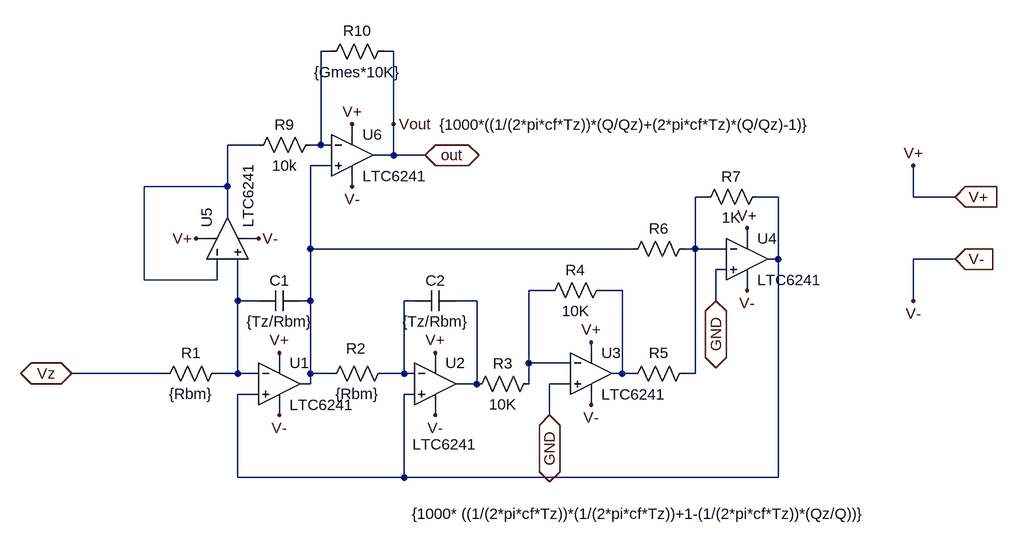
[diagram p0: schematic resonAO.asc]
resonAO.asc, the LTspice schematic file:
Version 4
SHEET 1 1308 680
WIRE 256 -144 240 -144
WIRE 352 -144 336 -144
WIRE 352 -32 352 -144
WIRE 288 -16 288 -32
WIRE 144 0 96 0
WIRE 240 0 240 -144
WIRE 240 0 224 0
WIRE 256 0 240 0
WIRE 352 16 352 -32
WIRE 352 16 320 16
WIRE 400 16 352 16
WIRE 256 32 224 32
WIRE 96 64 96 0
WIRE 96 64 -32 64
WIRE 288 64 288 48
WIRE 832 80 816 80
WIRE 944 80 912 80
WIRE 1152 80 1152 32
WIRE 1216 80 1152 80
WIRE 96 112 96 64
WIRE 64 144 48 144
WIRE 144 144 128 144
WIRE 896 144 896 128
WIRE 224 160 224 32
WIRE 720 160 224 160
WIRE 816 160 816 80
WIRE 816 160 800 160
WIRE 864 160 816 160
WIRE 944 176 944 80
WIRE 944 176 928 176
WIRE 1216 176 1152 176
WIRE 864 192 848 192
WIRE -32 208 -32 64
WIRE 80 208 80 176
WIRE 80 208 -32 208
WIRE 592 224 560 224
WIRE 704 224 672 224
WIRE 896 224 896 208
WIRE 112 240 112 176
WIRE 144 240 112 240
WIRE 224 240 224 160
WIRE 224 240 208 240
WIRE 384 240 368 240
WIRE 480 240 448 240
WIRE 848 240 848 192
WIRE 1152 240 1152 176
WIRE 656 320 656 304
WIRE 176 336 176 320
WIRE 416 336 416 320
WIRE 560 336 560 224
WIRE 624 336 560 336
WIRE 0 352 -144 352
WIRE 112 352 112 240
WIRE 112 352 80 352
WIRE 144 352 112 352
WIRE 224 352 224 240
WIRE 256 352 224 352
WIRE 368 352 368 240
WIRE 368 352 336 352
WIRE 384 352 368 352
WIRE 704 352 704 224
WIRE 704 352 688 352
WIRE 720 352 704 352
WIRE 816 352 816 160
WIRE 816 352 800 352
WIRE 224 368 224 352
WIRE 224 368 208 368
WIRE 480 368 480 240
WIRE 480 368 448 368
WIRE 560 368 560 336
WIRE 624 368 592 368
WIRE 144 384 112 384
WIRE 384 384 368 384
WIRE 656 400 656 384
WIRE 176 416 176 400
WIRE 416 416 416 400
WIRE 592 416 592 368
WIRE 112 512 112 384
WIRE 368 512 368 384
WIRE 368 512 112 512
WIRE 944 512 944 176
WIRE 944 512 368 512
FLAG 352 -32 Vout
FLAG -144 352 Vz
IOPIN -144 352 BiDir
FLAG 1216 80 V+
IOPIN 1216 80 In
FLAG 1216 176 V-
IOPIN 1216 176 In
FLAG 400 16 out
IOPIN 400 16 BiDir
FLAG 592 416 GND
IOPIN 592 416 BiDir
FLAG 848 240 GND
IOPIN 848 240 BiDir
FLAG 1152 32 V+
FLAG 896 128 V+
FLAG 656 304 V+
FLAG 416 320 V+
FLAG 48 144 V+
FLAG 176 320 V+
FLAG 288 -32 V+
FLAG 1152 240 V-
FLAG 656 400 V-
FLAG 896 224 V-
FLAG 416 416 V-
FLAG 176 416 V-
FLAG 144 144 V-
FLAG 288 64 V-
SYMBOL res 352 336 R90
WINDOW 0 -7 58 VBottom 0
WINDOW 3 32 56 VTop 0
SYMATTR InstName R2
SYMATTR Value {Rbm}
SYMBOL res 96 336 R90
WINDOW 0 0 56 VBottom 0
WINDOW 3 32 56 VTop 0
SYMATTR InstName R1
SYMATTR Value {Rbm}
SYMBOL res 816 336 R90
WINDOW 0 0 56 VBottom 0
WINDOW 3 216 84 VTop 0
SYMATTR InstName R5
SYMATTR Value {1000* ((1/(2*pi*cf*Tz))*(1/(2*pi*cf*Tz))+1-(1/(2*pi*cf*Tz))*(Qz/Q))}
SYMBOL res 816 144 R90
WINDOW 0 0 56 VBottom 0
WINDOW 3 -191 106 VTop 0
SYMATTR InstName R6
SYMATTR Value {1000*((1/(2*pi*cf*Tz))*(Q/Qz)+(2*pi*cf*Tz)*(Q/Qz)-1)}
SYMBOL res 928 64 R90
WINDOW 0 0 56 VBottom 0
WINDOW 3 32 56 VTop 0
SYMATTR InstName R7
SYMATTR Value 1K
SYMBOL cap 208 224 R90
WINDOW 0 0 32 VBottom 0
WINDOW 3 32 32 VTop 0
SYMATTR InstName C1
SYMATTR Value {Tz/Rbm}
SYMATTR SpiceLine ic=0
SYMBOL cap 448 224 R90
WINDOW 0 0 32 VBottom 0
WINDOW 3 32 32 VTop 0
SYMATTR InstName C2
SYMATTR Value {Tz/Rbm}
SYMATTR SpiceLine ic=0
SYMBOL res 688 208 R90
WINDOW 0 0 56 VBottom 0
WINDOW 3 32 56 VTop 0
SYMATTR InstName R4
SYMATTR Value 10K
SYMBOL res 576 352 R90
WINDOW 0 0 56 VBottom 0
WINDOW 3 32 56 VTop 0
SYMATTR InstName R3
SYMATTR Value 10K
SYMBOL res 240 -16 R90
WINDOW 0 0 56 VBottom 0
WINDOW 3 32 56 VTop 0
SYMATTR InstName R9
SYMATTR Value 10k
SYMBOL res 352 -160 R90
WINDOW 0 0 56 VBottom 0
WINDOW 3 32 56 VTop 0
SYMATTR InstName R10
SYMATTR Value {Gmes*10K}
SYMBOL Opamps\\LTC6241 176 368 R0
SYMATTR InstName U1
SYMBOL Opamps\\LTC6241 416 368 R0
WINDOW 3 -35 93 Left 0
SYMATTR InstName U2
SYMBOL Opamps\\LTC6241 656 352 R0
SYMATTR InstName U3
SYMBOL Opamps\\LTC6241 896 176 R0
SYMATTR InstName U4
SYMBOL Opamps\\LTC6241 96 144 R270
SYMATTR InstName U5
SYMBOL Opamps\\LTC6241 288 16 R0
SYMATTR InstName U6

The netlist it stands for:
* resonAO.asc
R2 N009 N003 {Rbm}
R1 N008 Vz {Rbm}
R5 N004 N007 {1000* ((1/(2*pi*cf*Tz))*(1/(2*pi*cf*Tz))+1-(1/(2*pi*cf*Tz))*(Qz/Q))}
R6 N004 N003 {1000*((1/(2*pi*cf*Tz))*(Q/Qz)+(2*pi*cf*Tz)*(Q/Qz)-1)}
R7 N005 N004 1K
C1 N003 N008 {Tz/Rbm} ic=0
C2 N010 N009 {Tz/Rbm} ic=0
R4 N007 N006 10K
R3 N006 N010 10K
R9 N001 N002 10k
R10 out N001 {Gmes*10K}
XU1 N005 N008 V+ V- N003 LTC6241  ; pins In+ In- V+ V- OUT
XU2 N005 N009 V+ V- N010 LTC6241  ; pins In+ In- V+ V- OUT
XU3 GND N006 V+ V- N007 LTC6241  ; pins In+ In- V+ V- OUT
XU4 GND N004 V+ V- N005 LTC6241  ; pins In+ In- V+ V- OUT
XU5 N008 N002 V+ V- N002 LTC6241  ; pins In+ In- V+ V- OUT
XU6 N003 N001 V+ V- out LTC6241  ; pins In+ In- V+ V- OUT
.lib LTC4.lib
.backanno
.end